# EAGLE schematic Line Follower Wrong (EAGLE 6.1)
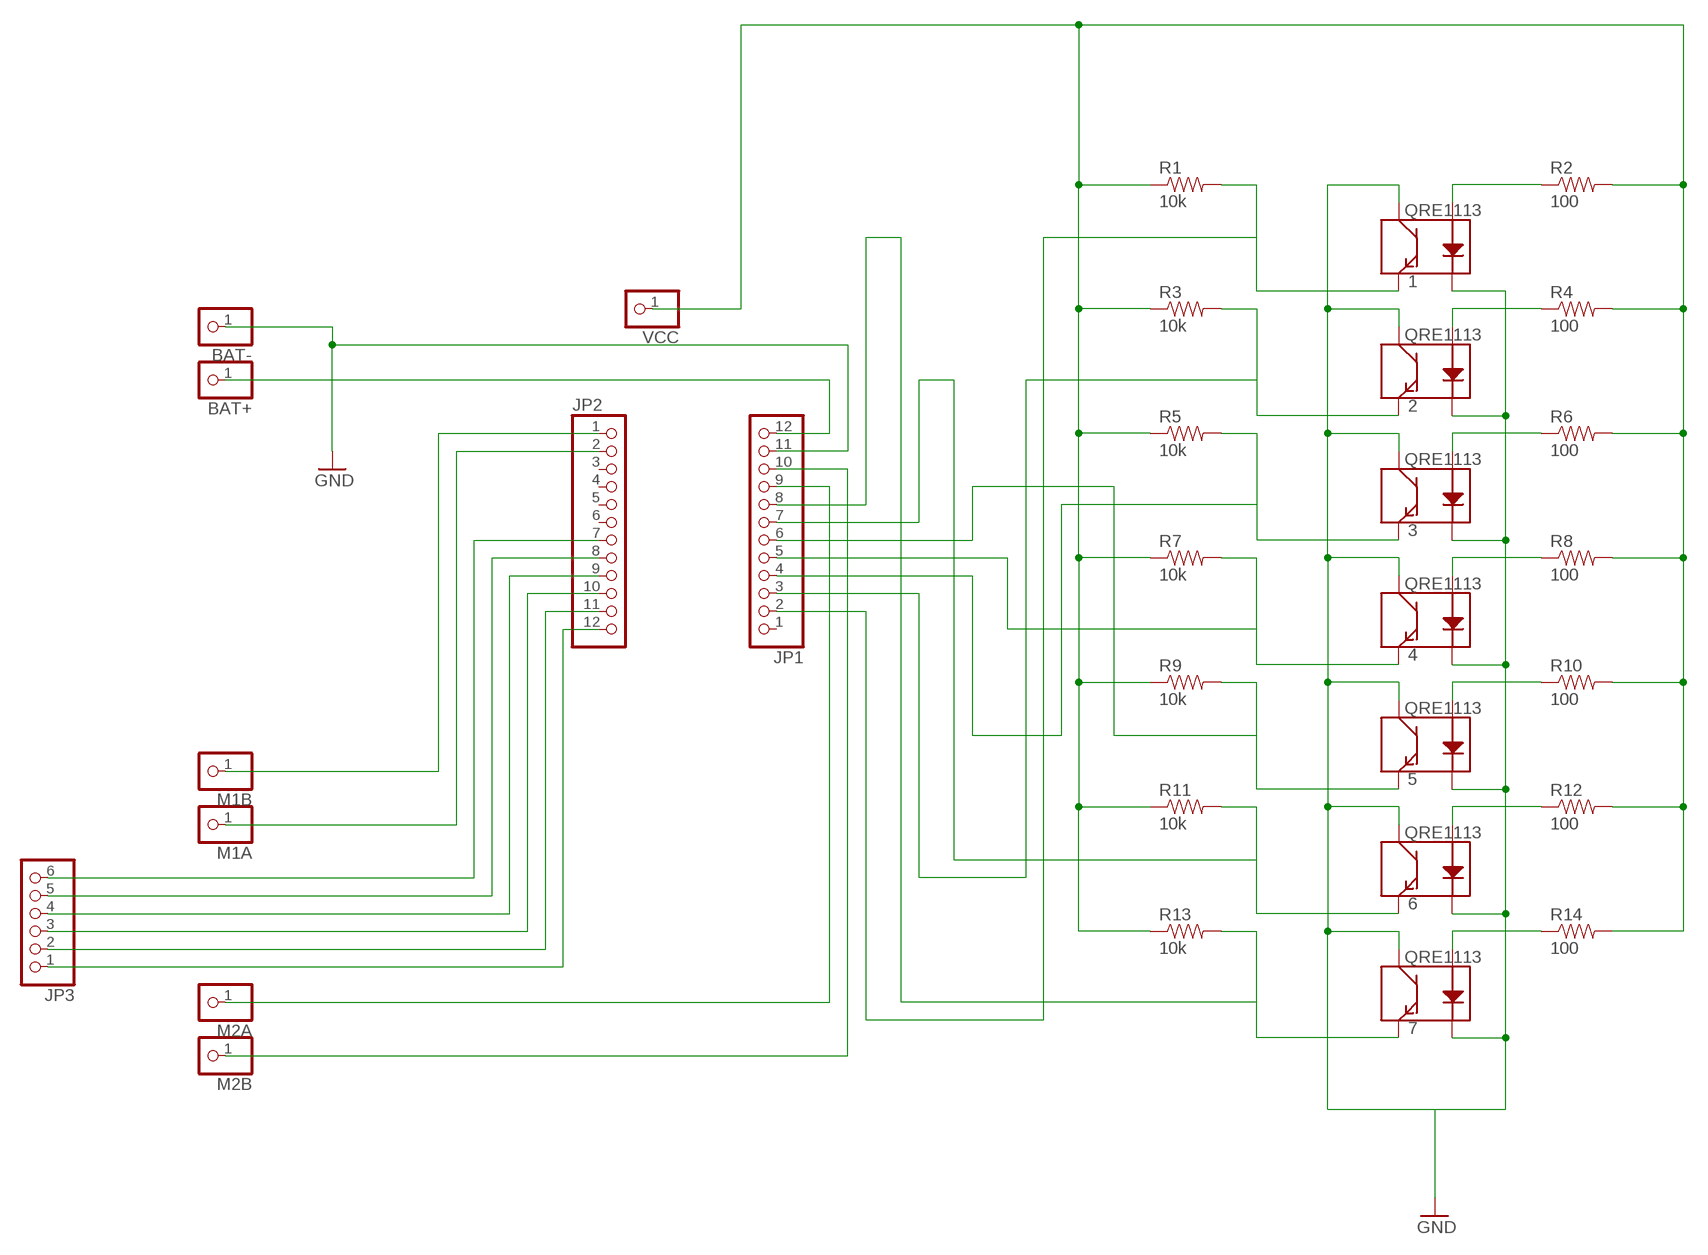
[diagram p0: schematic, sheet 1]

## Parts
1  QRE1113  [QRE1113]
2  QRE1113  [QRE1113]
3  QRE1113  [QRE1113]
4  QRE1113  [QRE1113]
5  QRE1113  [QRE1113]
6  QRE1113  [QRE1113]
7  QRE1113  [QRE1113]
BAT+  PINHD-1X1  [1X01]
BAT-  PINHD-1X1  [1X01]
JP1  PINHD-1X12  [1X12]
JP2  PINHD-1X12  [1X12]
JP3  PINHD-1X6  [1X06]
M1A  PINHD-1X1  [1X01]
M1B  PINHD-1X1  [1X01]
M2A  PINHD-1X1  [1X01]
M2B  PINHD-1X1  [1X01]
R1  10k  RESISTOR0603-RES  [0603-RES]
R2  100  RESISTOR0805-RES  [0805]
R3  10k  RESISTOR0603-RES  [0603-RES]
R4  100  RESISTOR0805-RES  [0805]
R5  10k  RESISTOR0603-RES  [0603-RES]
R6  100  RESISTOR0805-RES  [0805]
R7  10k  RESISTOR0603-RES  [0603-RES]
R8  100  RESISTOR0805-RES  [0805]
R9  10k  RESISTOR0603-RES  [0603-RES]
R10  100  RESISTOR0805-RES  [0805]
R11  10k  RESISTOR0603-RES  [0603-RES]
R12  100  RESISTOR0805-RES  [0805]
R13  10k  RESISTOR0603-RES  [0603-RES]
R14  100  RESISTOR0805-RES  [0805]
VCC  PINHD-1X1  [1X01]

## Nets
GND: 1.2(K) 1.3(C) 2.2(K) 2.3(C) 3.2(K) 3.3(C) 4.2(K) 4.3(C) 5.2(K) 5.3(C) 6.2(K) 6.3(C) 7.2(K) 7.3(C) BAT-.1 JP1.11
N$2: 2.4(E) JP1.3 R3.2
N$3: 3.4(E) JP1.4 R5.2
N$4: 4.4(E) JP1.5 R7.2
N$5: BAT+.1 JP1.12
N$6: JP2.7 JP3.6
N$7: JP2.8 JP3.5
N$8: 1.1(A) R2.1
N$9: 2.1(A) R4.1
N$10: 3.1(A) R6.1
N$11: 4.1(A) R8.1
N$12: 5.1(A) R10.1
N$13: 6.1(A) R12.1
N$14: 7.1(A) R14.1
N$15: R1.1 R2.2 R3.1 R4.2 R5.1 R6.2 R7.1 R8.2 R9.1 R10.2 R11.1 R12.2 R13.1 R14.2 VCC.1
N$16: JP2.9 JP3.4
N$17: JP2.10 JP3.3
N$19: JP2.11 JP3.2
N$20: JP2.12 JP3.1
N$21: 1.4(E) JP1.2 R1.2
N$24: 5.4(E) JP1.6 R9.2
N$25: JP2.1 M1B.1
N$26: JP2.2 M1A.1
N$27: JP1.9 M2A.1
N$28: JP1.10 M2B.1
N$29: 6.4(E) JP1.7 R11.2
N$33: 7.4(E) JP1.8 R13.2
Unconnected: JP1.1 JP2.3 JP2.4 JP2.5 JP2.6

## Library data of the parts
1-7 = SparkFun:QRE1113
BAT+ BAT- M1A M1B M2A M2B VCC = adafruit:PINHD-1X1: Pin header 1x1 for 0.1" spacing With round pins
JP1 JP2 = adafruit:PINHD-1X12: PIN HEADER
JP3 = adafruit:PINHD-1X6: PIN HEADER
R1-R14 = SparkFun:RESISTOR: Resistor Basic schematic elements and footprints for 0603, 1206, and PTH resistors.